# Altium schematic sheet LongLedPcb.SchDoc
size A4; DocumentNumber: 1; SheetNumber: 1; SheetTotal: 1
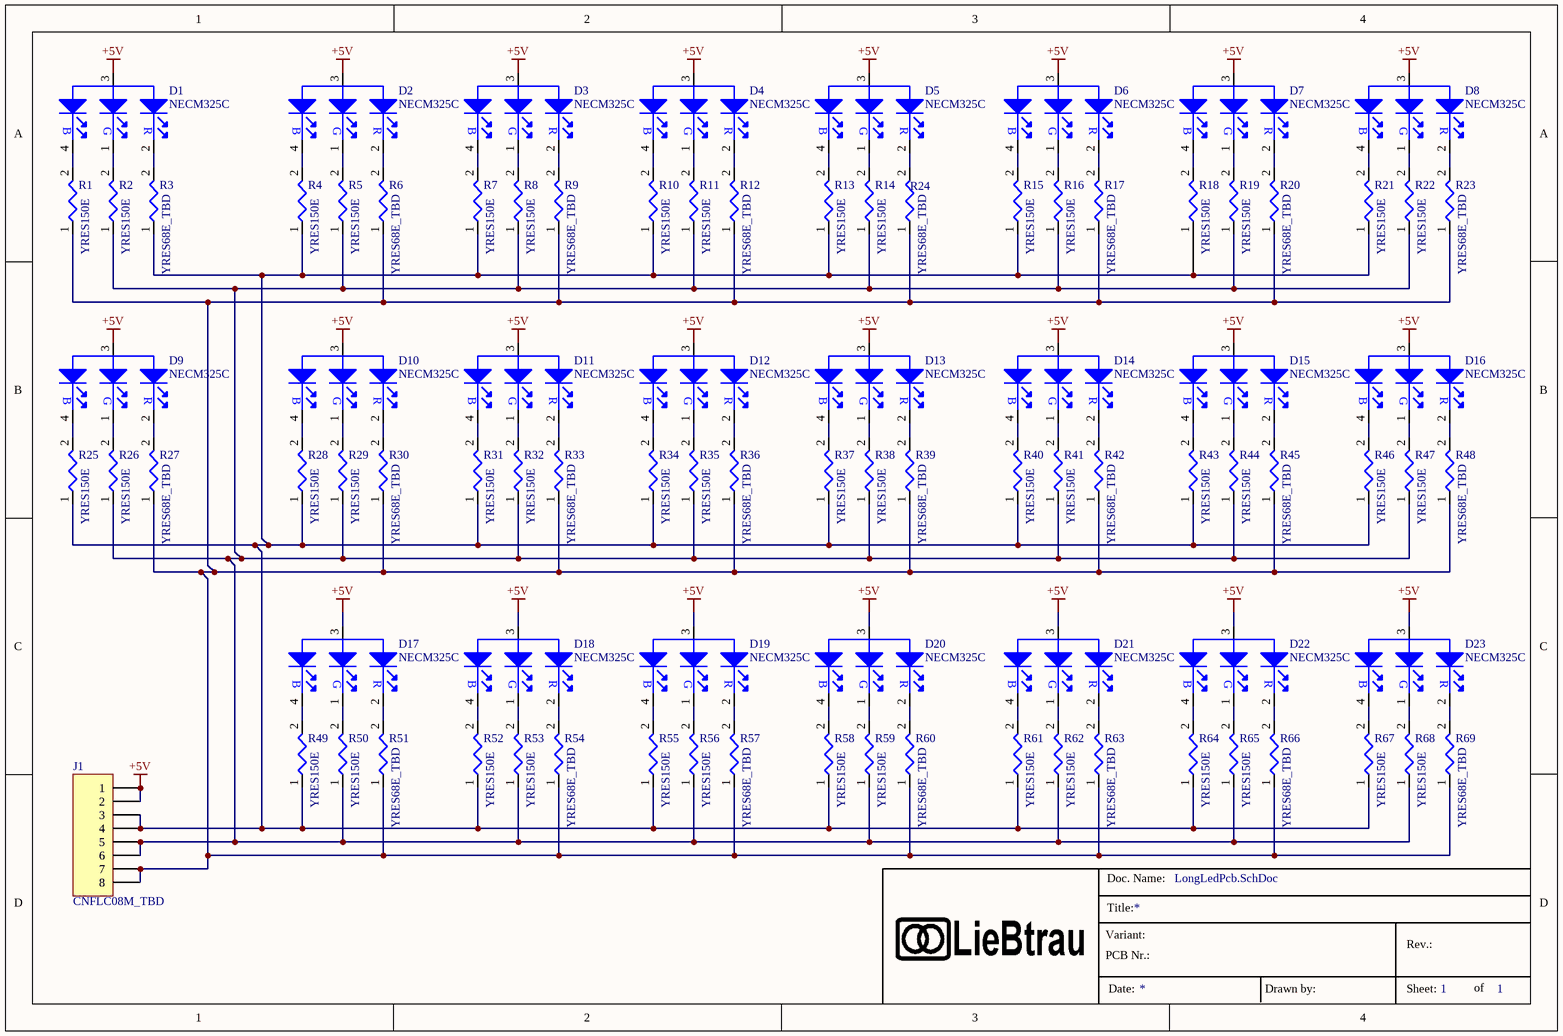
[diagram p0: LongLedPcb.SchDoc]

## Parts
D1  NECM325C  [D_NECM325C]
D2  NECM325C  [D_NECM325C]
D3  NECM325C  [D_NECM325C]
D4  NECM325C  [D_NECM325C]
D5  NECM325C  [D_NECM325C]
D6  NECM325C  [D_NECM325C]
D7  NECM325C  [D_NECM325C]
D8  NECM325C  [D_NECM325C]
D9  NECM325C  [D_NECM325C]
D10  NECM325C  [D_NECM325C]
D11  NECM325C  [D_NECM325C]
D12  NECM325C  [D_NECM325C]
D13  NECM325C  [D_NECM325C]
D14  NECM325C  [D_NECM325C]
D15  NECM325C  [D_NECM325C]
D16  NECM325C  [D_NECM325C]
D17  NECM325C  [D_NECM325C]
D18  NECM325C  [D_NECM325C]
D19  NECM325C  [D_NECM325C]
D20  NECM325C  [D_NECM325C]
D21  NECM325C  [D_NECM325C]
D22  NECM325C  [D_NECM325C]
D23  NECM325C  [D_NECM325C]
J1  CNFLC08M_TBD  [J_215079-8]
R1  YRES150E  [R_1206]
R2  YRES150E  [R_1206]
R3  YRES68E_TBD  [R_1206]
R4  YRES150E  [R_1206]
R5  YRES150E  [R_1206]
R6  YRES68E_TBD  [R_1206]
R7  YRES150E  [R_1206]
R8  YRES150E  [R_1206]
R9  YRES68E_TBD  [R_1206]
R10  YRES150E  [R_1206]
R11  YRES150E  [R_1206]
R12  YRES68E_TBD  [R_1206]
R13  YRES150E  [R_1206]
R14  YRES150E  [R_1206]
R15  YRES150E  [R_1206]
R16  YRES150E  [R_1206]
R17  YRES68E_TBD  [R_1206]
R18  YRES150E  [R_1206]
R19  YRES150E  [R_1206]
R20  YRES68E_TBD  [R_1206]
R21  YRES150E  [R_1206]
R22  YRES150E  [R_1206]
R23  YRES68E_TBD  [R_1206]
R24  YRES68E_TBD  [R_1206]
R25  YRES150E  [R_1206]
R26  YRES150E  [R_1206]
R27  YRES68E_TBD  [R_1206]
R28  YRES150E  [R_1206]
R29  YRES150E  [R_1206]
R30  YRES68E_TBD  [R_1206]
R31  YRES150E  [R_1206]
R32  YRES150E  [R_1206]
R33  YRES68E_TBD  [R_1206]
R34  YRES150E  [R_1206]
R35  YRES150E  [R_1206]
R36  YRES68E_TBD  [R_1206]
R37  YRES150E  [R_1206]
R38  YRES150E  [R_1206]
R39  YRES68E_TBD  [R_1206]
R40  YRES150E  [R_1206]
R41  YRES150E  [R_1206]
R42  YRES68E_TBD  [R_1206]
R43  YRES150E  [R_1206]
R44  YRES150E  [R_1206]
R45  YRES68E_TBD  [R_1206]
R46  YRES150E  [R_1206]
R47  YRES150E  [R_1206]
R48  YRES68E_TBD  [R_1206]
R49  YRES150E  [R_1206]
R50  YRES150E  [R_1206]
R51  YRES68E_TBD  [R_1206]
R52  YRES150E  [R_1206]
R53  YRES150E  [R_1206]
R54  YRES68E_TBD  [R_1206]
R55  YRES150E  [R_1206]
R56  YRES150E  [R_1206]
R57  YRES68E_TBD  [R_1206]
R58  YRES150E  [R_1206]
R59  YRES150E  [R_1206]
R60  YRES68E_TBD  [R_1206]
R61  YRES150E  [R_1206]
R62  YRES150E  [R_1206]
R63  YRES68E_TBD  [R_1206]
R64  YRES150E  [R_1206]
R65  YRES150E  [R_1206]
R66  YRES68E_TBD  [R_1206]
R67  YRES150E  [R_1206]
R68  YRES150E  [R_1206]
R69  YRES68E_TBD  [R_1206]

## Nets
+5V: D1.3(A) D2.3(A) D3.3(A) D4.3(A) D5.3(A) D6.3(A) D7.3(A) D8.3(A) D9.3(A) D10.3(A) D11.3(A) D12.3(A) D13.3(A) D14.3(A) D15.3(A) D16.3(A) D17.3(A) D18.3(A) D19.3(A) D20.3(A) D21.3(A) D22.3(A) D23.3(A) J1.1 J1.2
NetD1_1: D1.1(C) R2.2
NetD1_2: D1.2(C) R3.2
NetD1_4: D1.4(C) R1.2
NetD2_1: D2.1(C) R5.2
NetD2_2: D2.2(C) R6.2
NetD2_4: D2.4(C) R4.2
NetD3_1: D3.1(C) R8.2
NetD3_2: D3.2(C) R9.2
NetD3_4: D3.4(C) R7.2
NetD4_1: D4.1(C) R11.2
NetD4_2: D4.2(C) R12.2
NetD4_4: D4.4(C) R10.2
NetD5_1: D5.1(C) R14.2
NetD5_2: D5.2(C) R24.2
NetD5_4: D5.4(C) R13.2
NetD6_1: D6.1(C) R16.2
NetD6_2: D6.2(C) R17.2
NetD6_4: D6.4(C) R15.2
NetD7_1: D7.1(C) R19.2
NetD7_2: D7.2(C) R20.2
NetD7_4: D7.4(C) R18.2
NetD8_1: D8.1(C) R22.2
NetD8_2: D8.2(C) R23.2
NetD8_4: D8.4(C) R21.2
NetD9_1: D9.1(C) R26.2
NetD9_2: D9.2(C) R27.2
NetD9_4: D9.4(C) R25.2
NetD10_1: D10.1(C) R29.2
NetD10_2: D10.2(C) R30.2
NetD10_4: D10.4(C) R28.2
NetD11_1: D11.1(C) R32.2
NetD11_2: D11.2(C) R33.2
NetD11_4: D11.4(C) R31.2
NetD12_1: D12.1(C) R35.2
NetD12_2: D12.2(C) R36.2
NetD12_4: D12.4(C) R34.2
NetD13_1: D13.1(C) R38.2
NetD13_2: D13.2(C) R39.2
NetD13_4: D13.4(C) R37.2
NetD14_1: D14.1(C) R41.2
NetD14_2: D14.2(C) R42.2
NetD14_4: D14.4(C) R40.2
NetD15_1: D15.1(C) R44.2
NetD15_2: D15.2(C) R45.2
NetD15_4: D15.4(C) R43.2
NetD16_1: D16.1(C) R47.2
NetD16_2: D16.2(C) R48.2
NetD16_4: D16.4(C) R46.2
NetD17_1: D17.1(C) R50.2
NetD17_2: D17.2(C) R51.2
NetD17_4: D17.4(C) R49.2
NetD18_1: D18.1(C) R53.2
NetD18_2: D18.2(C) R54.2
NetD18_4: D18.4(C) R52.2
NetD19_1: D19.1(C) R56.2
NetD19_2: D19.2(C) R57.2
NetD19_4: D19.4(C) R55.2
NetD20_1: D20.1(C) R59.2
NetD20_2: D20.2(C) R60.2
NetD20_4: D20.4(C) R58.2
NetD21_1: D21.1(C) R62.2
NetD21_2: D21.2(C) R63.2
NetD21_4: D21.4(C) R61.2
NetD22_1: D22.1(C) R65.2
NetD22_2: D22.2(C) R66.2
NetD22_4: D22.4(C) R64.2
NetD23_1: D23.1(C) R68.2
NetD23_2: D23.2(C) R69.2
NetD23_4: D23.4(C) R67.2
NetJ1_3: J1.3 J1.4 R3.1 R4.1 R7.1 R10.1 R13.1 R15.1 R18.1 R21.1 R25.1 R28.1 R31.1 R34.1 R37.1 R40.1 R43.1 R46.1 R49.1 R52.1 R55.1 R58.1 R61.1 R64.1 R67.1
NetJ1_5: J1.5 J1.6 R2.1 R5.1 R8.1 R11.1 R14.1 R16.1 R19.1 R22.1 R26.1 R29.1 R32.1 R35.1 R38.1 R41.1 R44.1 R47.1 R50.1 R53.1 R56.1 R59.1 R62.1 R65.1 R68.1
NetJ1_7: J1.7 J1.8 R1.1 R6.1 R9.1 R12.1 R17.1 R20.1 R23.1 R24.1 R27.1 R30.1 R33.1 R36.1 R39.1 R42.1 R45.1 R48.1 R51.1 R54.1 R57.1 R60.1 R63.1 R66.1 R69.1

## Notes on the sheet
- Title:
- Doc. Name:
- Variant:
- PCB Nr.:
- Date:
- Drawn by:
- Rev.:
- Sheet:
- of
- (in symbol NECM325C) B; G; R

## Library data of the parts
J1 = CNFLC08F_TBD: *; Order Code: Farnell 1641857; Part Number: CNFLC08F_TBD
R1 R2 R4 R5 R7 R8 R10 R11 R13-R16 R18 R19 R21 R22 R25 R26 R28 R29 R31 R32 R34 R35 R37 R38 R40 R41 R43 R44 R46 R47 R49 R50 R52 R53 R55 R56 R58 R59 R61 R62 R64 R65 R67 R68 = YRES150E: Resistor; Part Number: YRES150E
R3 R6 R9 R12 R17 R20 R23 R24 R27 R30 R33 R36 R39 R42 R45 R48 R51 R54 R57 R60 R63 R66 R69 = YRES68E_TBD: Resistor; Part Number: YRES68E_TBD
D1-D23 = NECM325C: Part Number: NECM325C